# EAGLE schematic Stort kredslob (EAGLE 8.4.1)
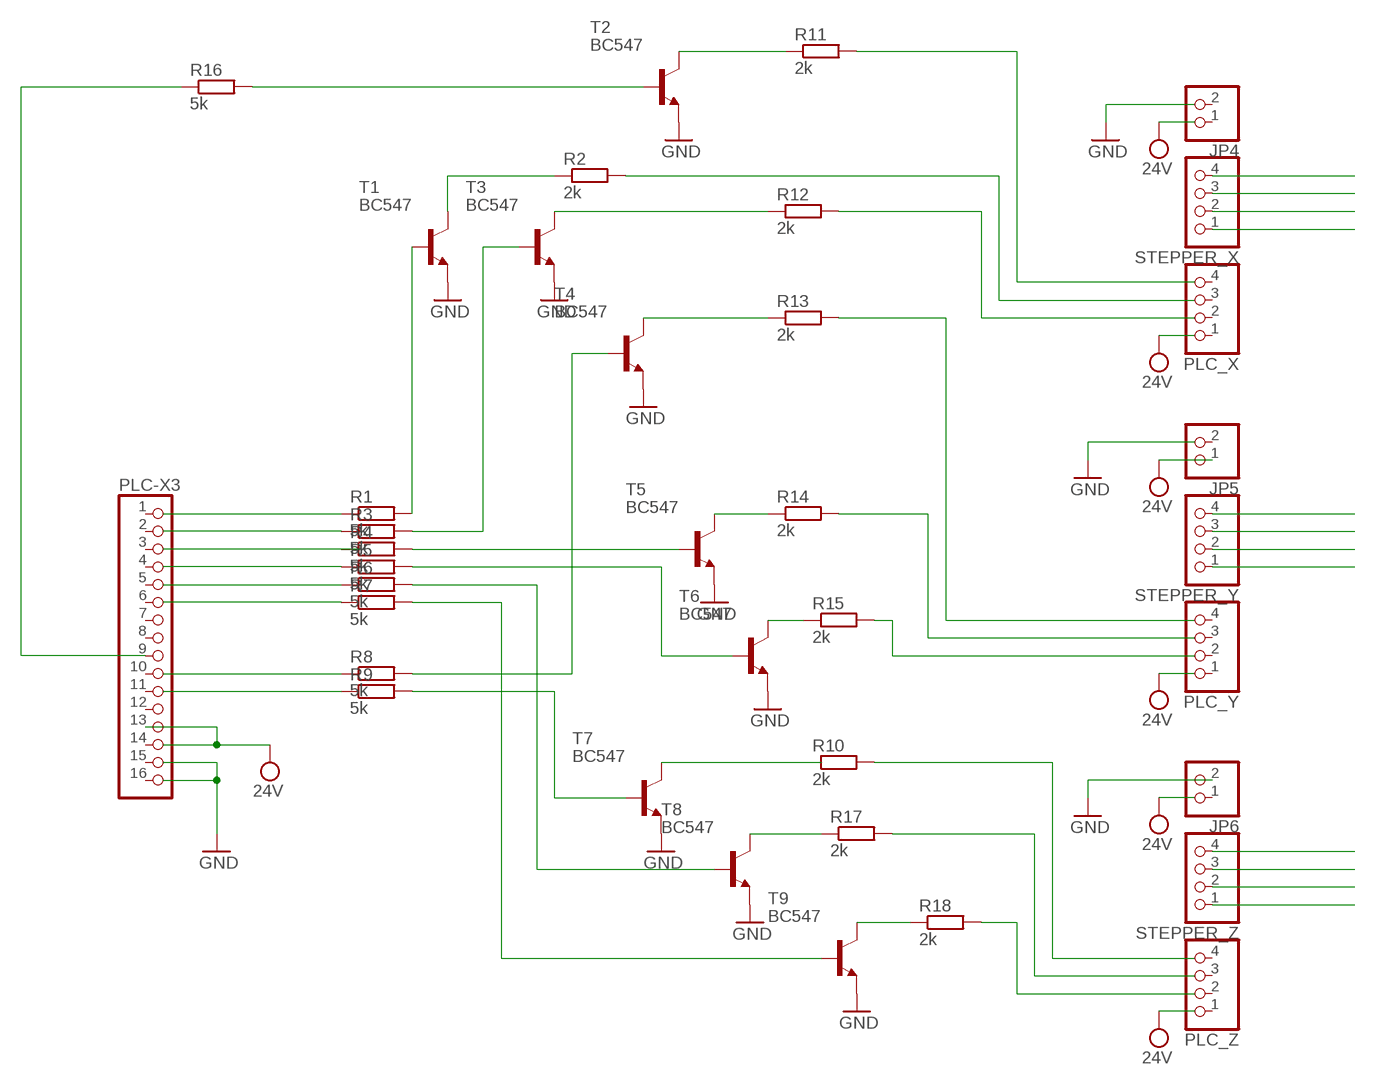
[diagram p0: schematic, sheet 1]

## Parts
JP4  PINHD-1X2  [1X02]
JP5  PINHD-1X2  [1X02]
JP6  PINHD-1X2  [1X02]
PLC-X3  PINHD-1X16  [1X16]
PLC_X  PINHD-1X4  [1X04]
PLC_Y  PINHD-1X4  [1X04]
PLC_Z  PINHD-1X4  [1X04]
R1  5k  R-EU_0207/10  [0207/10]
R2  2k  R-EU_0207/10  [0207/10]
R3  5k  R-EU_0207/10  [0207/10]
R4  5k  R-EU_0207/10  [0207/10]
R5  5k  R-EU_0207/10  [0207/10]
R6  5k  R-EU_0207/10  [0207/10]
R7  5k  R-EU_0207/10  [0207/10]
R8  5k  R-EU_0207/10  [0207/10]
R9  5k  R-EU_0207/10  [0207/10]
R10  2k  R-EU_0207/10  [0207/10]
R11  2k  R-EU_0207/10  [0207/10]
R12  2k  R-EU_0207/10  [0207/10]
R13  2k  R-EU_0207/10  [0207/10]
R14  2k  R-EU_0207/10  [0207/10]
R15  2k  R-EU_0207/10  [0207/10]
R16  5k  R-EU_0207/10  [0207/10]
R17  2k  R-EU_0207/10  [0207/10]
R18  2k  R-EU_0207/10  [0207/10]
STEPPER_X  PINHD-1X4  [1X04]
STEPPER_Y  PINHD-1X4  [1X04]
STEPPER_Z  PINHD-1X4  [1X04]
T1  BC547  -NPN-TO92-E1  [TO92-E1]
T2  BC547  -NPN-TO92-E1  [TO92-E1]
T3  BC547  -NPN-TO92-E1  [TO92-E1]
T4  BC547  -NPN-TO92-E1  [TO92-E1]
T5  BC547  -NPN-TO92-E1  [TO92-E1]
T6  BC547  -NPN-TO92-E1  [TO92-E1]
T7  BC547  -NPN-TO92-E1  [TO92-E1]
T8  BC547  -NPN-TO92-E1  [TO92-E1]
T9  BC547  -NPN-TO92-E1  [TO92-E1]

## Nets
GND: JP6.2 T1.3(E) T2.3(E) T3.3(E) T4.3(E) T5.3(E) T6.3(E) T7.3(E) T8.3(E) T9.3(E)
N$1: R1.1
N$2: R1.2 T1.2(B)
N$3: R2.1 T1.1(C)
N$4: STEPPER_X.3
N$5: STEPPER_X.2
N$6: STEPPER_X.1
N$7: STEPPER_Y.4
N$8: STEPPER_Y.3
N$9: STEPPER_Y.2
N$10: STEPPER_X.4
N$11: STEPPER_Y.1
N$12: STEPPER_Z.4
N$13: STEPPER_Z.3
N$14: STEPPER_Z.2
N$15: STEPPER_Z.1
N$16: R3.1
N$18: R5.1
N$19: R6.1
N$20: R7.1
N$21: R11.2
N$22: PLC-X3.9 R16.1
N$23: R11.1 T2.1(C)
N$24: R16.2 T2.2(B)
N$25: R2.2
N$26: R12.1 T3.1(C)
N$27: R12.2
N$28: R8.1
N$29: R3.2 T3.2(B)
N$30: R4.2 T5.2(B)
N$31: R8.2 T4.2(B)
N$32: R13.1 T4.1(C)
N$33: R13.2
N$34: R14.1 T5.1(C)
N$35: R14.2
N$36: R5.2 T6.2(B)
N$37: R15.1 T6.1(C)
N$38: R15.2
N$39: R9.1
N$40: R9.2 T7.2(B)
N$41: R10.1 T7.1(C)
N$42: R6.2 T8.2(B)
N$43: R7.2 T9.2(B)
N$44: R10.2
N$45: R17.1 T8.1(C)
N$46: R17.2
N$47: R18.1 T9.1(C)
N$48: R18.2
VCC: JP5.1 PLC-X3.13 ; supply symbol labelled 24V
Unconnected: JP4.1 JP4.2 JP5.2 JP6.1 PLC-X3.1 PLC-X3.2 PLC-X3.3 PLC-X3.4 PLC-X3.5 PLC-X3.6 PLC-X3.7 PLC-X3.8 PLC-X3.10 PLC-X3.11 PLC-X3.12 PLC-X3.14 PLC-X3.15 PLC-X3.16 PLC_X.1 PLC_X.2 PLC_X.3 PLC_X.4 PLC_Y.1 PLC_Y.2 PLC_Y.3 PLC_Y.4 PLC_Z.1 PLC_Z.2 PLC_Z.3 PLC_Z.4 R4.1

## Library data of the parts
JP4-JP6 = pinhead:PINHD-1X2: PIN HEADER
PLC-X3 = pinhead:PINHD-1X16: PIN HEADER
PLC_X PLC_Y PLC_Z STEPPER_X STEPPER_Y STEPPER_Z = pinhead:PINHD-1X4: PIN HEADER
R1-R18 = rcl:R-EU_: RESISTOR, European symbol
T1-T9 = transistor:*-NPN-: NPN Transistror BF959 corrected 2008.03.06